# Altium schematic sheet Oscilador.SchDoc
size A4
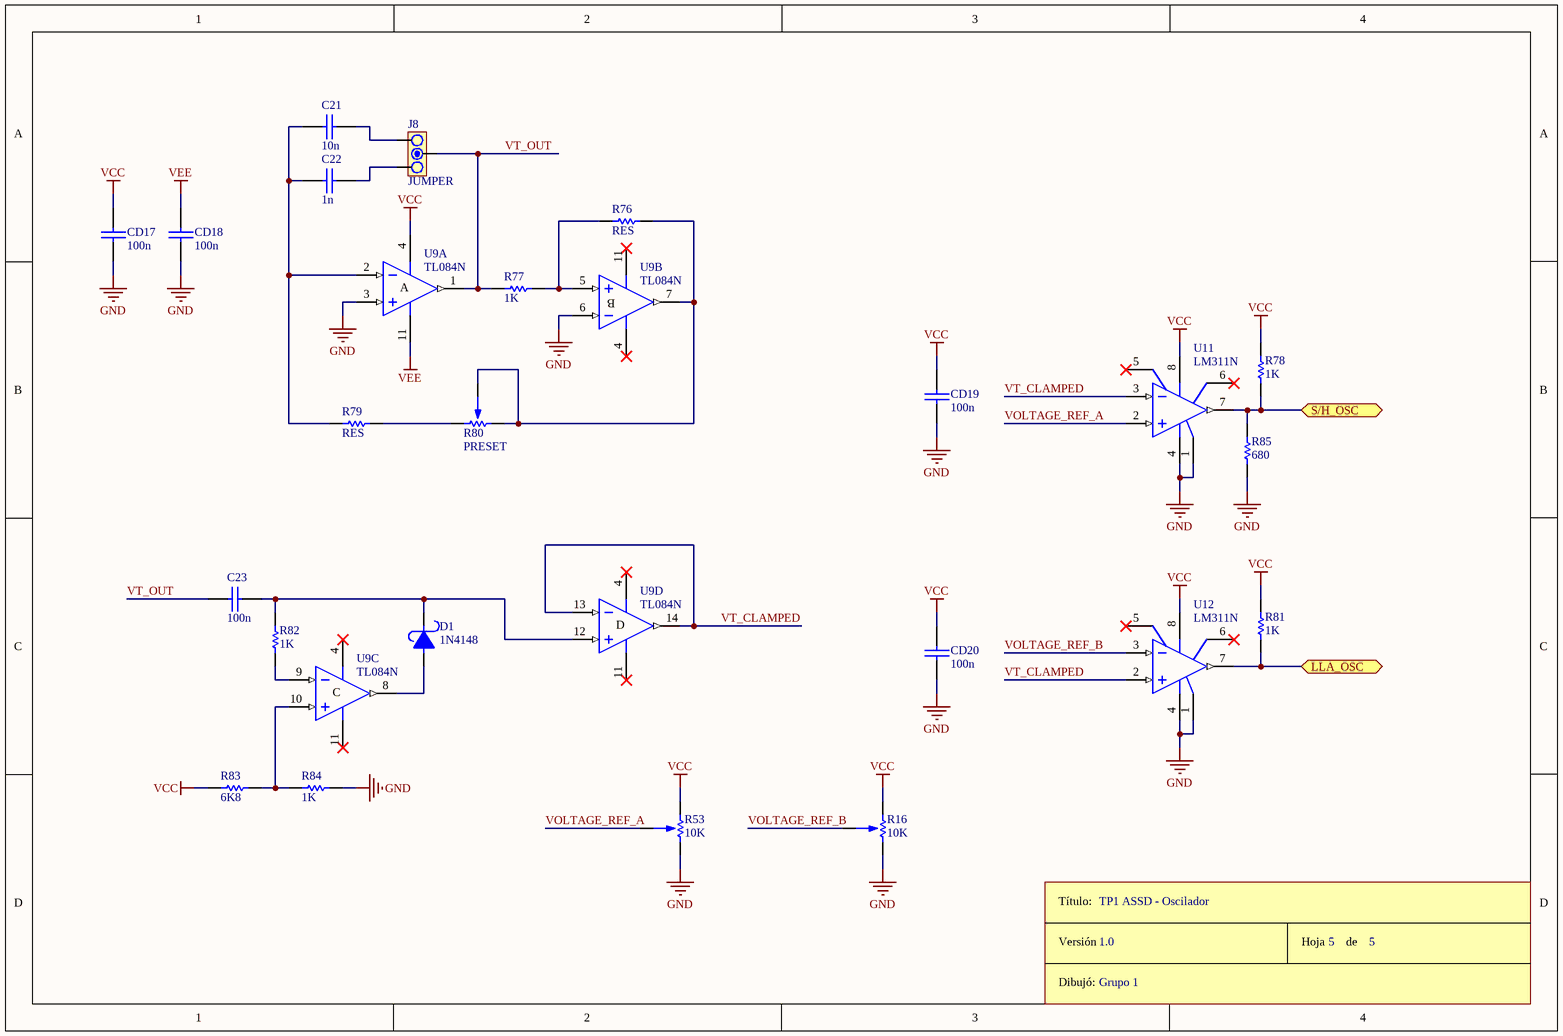
[diagram p0: Oscilador.SchDoc]

## Parts
C21  10n  [CAP100]
C22  1n  [CAP100]
C23  100n  [CAP100]
CD17  100n  [CAP100]
CD18  100n  [CAP100]
CD19  100n  [CAP100]
CD20  100n  [CAP100]
D1  1N4148  [DO41]
J8  JUMPER  [JUMPER3]
R16  10K  [PRESET V]
R53  10K  [PRESET V]
R76  RES  [RES400]
R77  1K  [RES400]
R78  1K  [RES400]
R79  RES  [RES400]
R80  PRESET  [PRESET V]
R81  1K  [RES400]
R82  1K  [RES400]
R83  6K8  [RES400]
R84  1K  [RES400]
R85  680  [RES400]
ROT5  Rótulo  (value not drawn)
U9  TL084N  [N014]  (parts A,B,C,D of 4)
U11  LM311N  [626-05]
U12  LM311N  [626-05]

## Ports
LLA_OSC, S/H_OSC

## Nets
GND: CD17.2 CD18.2 CD19.2 CD20.2 R16.1 R53.1 R84.2 R85.1 U9.3(IN+) U9.6(IN-) U11.1(GND) U11.4(V-) U12.1(GND) U12.4(V-)
VCC: CD17.1 CD19.1 CD20.1 R16.3 R53.3 R78.2 R81.2 R83.1 U9.4(V+) U11.8(V+) U12.8(V+)
VEE: CD18.1 U9.11(V-)
LLA_OSC: R81.1 U12.7(OUT) ; port LLA_OSC
S/H_OSC: R78.1 R85.2 U11.7(OUT) ; port S/H_OSC
VOLTAGE_REF_A: R53.2 U11.2(IN+)
VOLTAGE_REF_B: R16.2 U12.3(IN-)
VT_CLAMPED: U9.13(IN-) U9.14(OUT) U11.3(IN-) U12.2(IN+)
VT_OUT: C23.1 J8.2 R77.1 U9.1(OUT)
NetC21_1: C21.1 C22.1 R79.1 U9.2(IN-)
NetC21_2: C21.2 J8.3
NetC22_2: C22.2 J8.1
NetC23_2: C23.2 D1.2 R82.2 U9.12(IN+)
NetD1_1: D1.1 U9.8(OUT)
NetR76_1: R76.1 R77.2 U9.5(IN+)
NetR76_2: R76.2 R80.2 R80.3 U9.7(OUT)
NetR79_2: R79.2 R80.1
NetR82_1: R82.1 U9.9(IN-)
NetR83_2: R83.2 R84.1 U9.10(IN+)

Not connected (* = marked no-connect by the designer): U11 5(BAL)* 6(BAL/STB)*; U12 5(BAL)* 6(BAL/STB)*

## Notes on the sheet
- TP1 ASSD - Oscilador
- 1.0
- Grupo 1
- 5
- (in symbol Rótulo) Título:; Versión; Hoja       de; Dibujó:
- (in symbol TL084N, part A) A
- (in symbol TL084N, part B) B
- (in symbol TL084N, part C) C
- (in symbol TL084N, part D) D

## Library data of the parts
C21-C23 CD17-CD20 = CAP
D1 = DIODO SCHOTTKY
J8 = JUMPER3
R16 R53 = PRESET
R77 R78 R81-R85 = RES
U9 = TL084N: JFET-Input Operational Amplifier; Published: 16-Jan-2001; LatestRevisionDate: 04-Mar-2005; LatestRevisionNote: Stylized 3D Model Added.; DatasheetVersion: Feb-1999; PackageVersion: Oct-1995; PackageReference: N014; Publisher: Altium Limited; PackageDescription: DIP; 14 Leads; Row Spacing 7.62 mm; Pitch 2.54 mm; ComponentLink1Description: Manufacturer Link; ComponentLink1URL: http://www.ti.com/; ComponentLink2Description: Datasheet; ComponentLink2URL: http://www-s.ti.com/sc/ds/tl084.pdf
U11 U12 = LM311N: High-Performance Voltage Comparator; Published: 17-Jul-2002; LatestRevisionDate: 06-Jun-2005; LatestRevisionNote: Stylized 3D Model Added.; DatasheetVersion: 1988; PackageReference: 626-05; Publisher: Altium Limited; PackageDescription: DIP; 8 Leads; Row Spacing 7.62 mm; Pitch 2.54 mm; ComponentLink1Description: Manufacturer Link; ComponentLink1URL: http://www.onsemi.com/site/products/taxonomy/0,4438,133,00.html